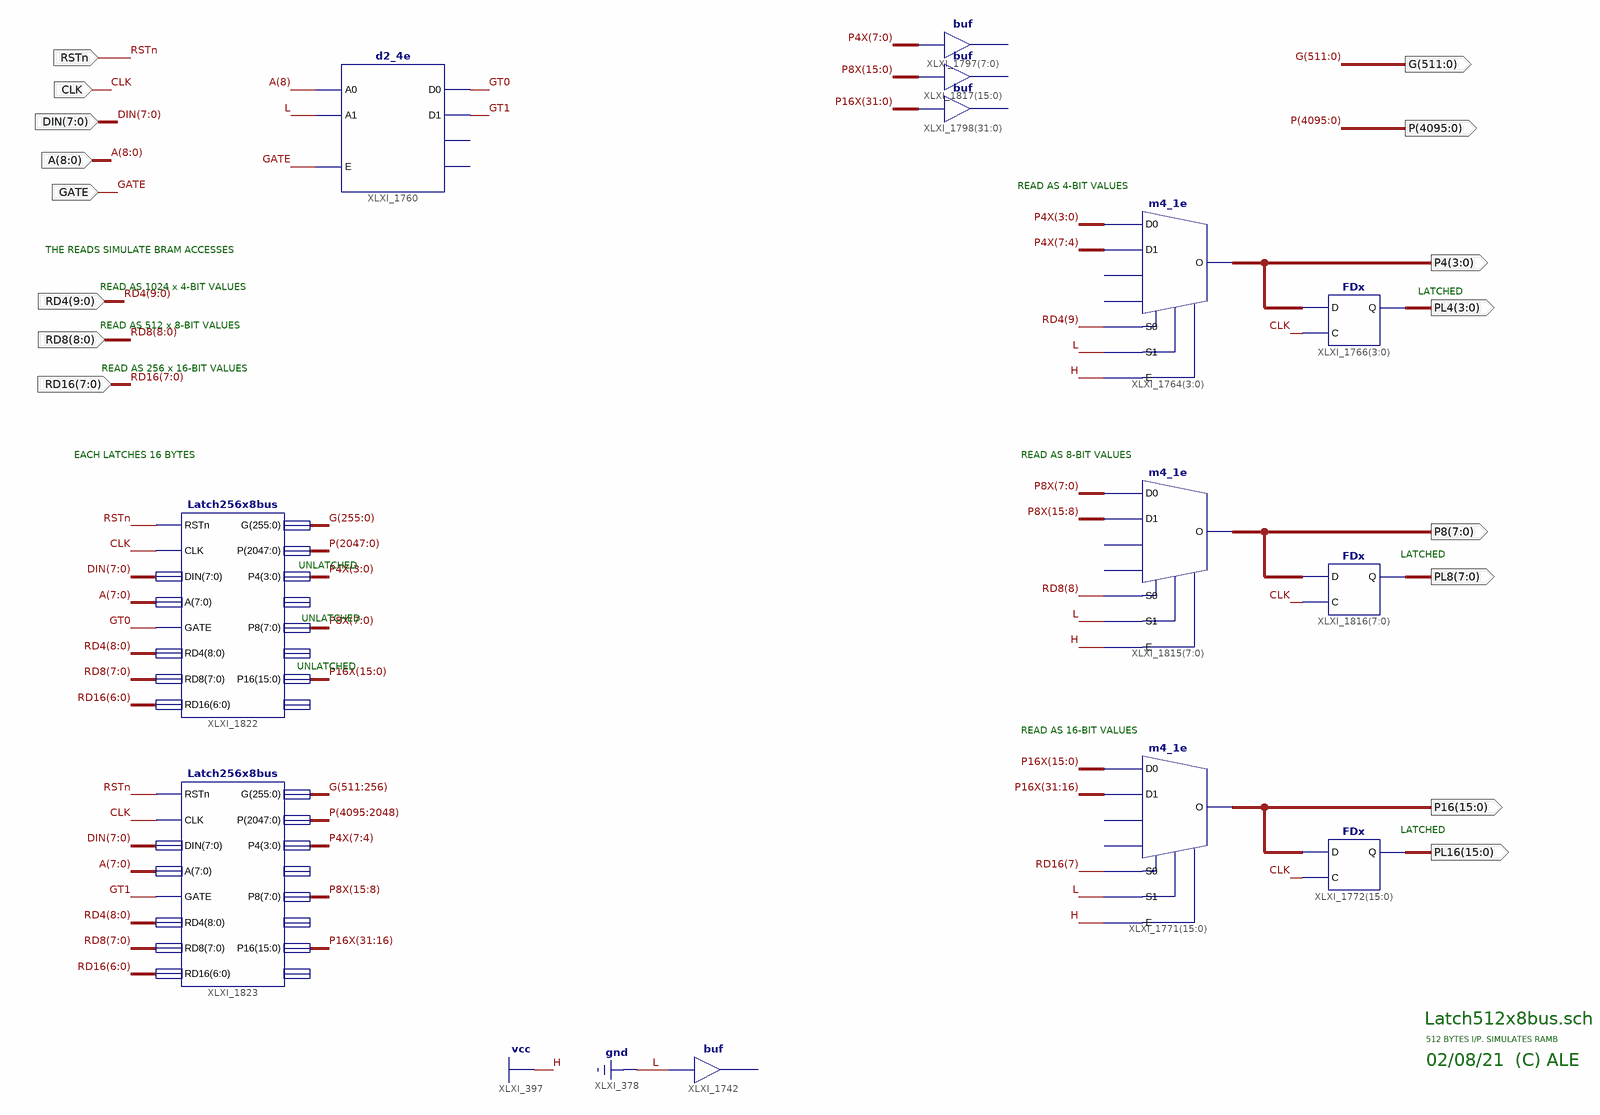
[diagram p0: schematic sheet 1]
// Xilinx ISE schematic Latch512x8bus.sch (spartan3e) as structural Verilog: 13 symbols, 22 ports
module Latch512x8bus (
  input  RSTn,
  input  [7:0] DIN,
  input  CLK,
  input  GATE,
  input  [9:0] RD4,
  input  [8:0] RD8,
  input  [7:0] RD16,
  input  [8:0] A,
  output [4095:0] P,
  output [3:0] P4,
  output [3:0] PL4,
  output [15:0] P16,
  output [15:0] PL16,
  output [7:0] P8,
  output [7:0] PL8,
  output [511:0] G
);

  wire GT0, GT1;
  wire [7:0] P4X;
  wire [15:0] P8X;
  wire [31:0] P16X;

  // buf XLXI_1742 has open pins: I=1'b0, O=open
  d2_4e XLXI_1760 (.A0(A[8]), .A1(1'b0), .E(GATE), .D0(GT0), .D1(GT1));  // open: D2, D3
  // buf XLXI_1798[31..0] has open pins: I=P16X, O=open
  m4_1e XLXI_1764[3:0] (.D0(P4X[3:0]), .D1(P4X[7:4]), .E(1'b1), .S0(RD4[9]), .S1(1'b0), .O(P4));  // open: D2, D3
  FDx XLXI_1766[3:0] (.C(CLK), .D(P4), .Q(PL4));
  m4_1e XLXI_1771[15:0] (
    .D0(P16X[15:0]), .D1(P16X[31:16]), .E(1'b1), .S0(RD16[7]), .S1(1'b0), .O(P16));  // open: D2, D3
  FDx XLXI_1772[15:0] (.C(CLK), .D(P16), .Q(PL16));
  m4_1e XLXI_1815[7:0] (.D0(P8X[7:0]), .D1(P8X[15:8]), .E(1'b1), .S0(RD8[8]), .S1(1'b0), .O(P8));  // open: D2, D3
  FDx XLXI_1816[7:0] (.C(CLK), .D(P8), .Q(PL8));
  // buf XLXI_1797[7..0] has open pins: I=P4X, O=open
  // buf XLXI_1817[15..0] has open pins: I=P8X, O=open
  Latch256x8bus XLXI_1822 (
    .A(A[7:0]), .CLK(CLK), .DIN(DIN), .G(G[255:0]), .GATE(GT0), .P(P[2047:0]), .P16(P16X[15:0]),
    .P4(P4X[3:0]), .P8(P8X[7:0]), .RD16(RD16[6:0]), .RD4(RD4[8:0]), .RD8(RD8[7:0]), .RSTn(RSTn));  // open: PL16, PL4, PL8
  Latch256x8bus XLXI_1823 (
    .A(A[7:0]), .CLK(CLK), .DIN(DIN), .G(G[511:256]), .GATE(GT1), .P(P[4095:2048]), .P16(P16X[31:16]),
    .P4(P4X[7:4]), .P8(P8X[15:8]), .RD16(RD16[6:0]), .RD4(RD4[8:0]), .RD8(RD8[7:0]), .RSTn(RSTn));  // open: PL16, PL4, PL8

  // Notes on the sheet:
  //   READ AS 4-BIT VALUES
  //   THE READS SIMULATE BRAM ACCESSES
  //   READ AS 1024 x 4-BIT VALUES
  //   LATCHED
  //   READ AS 512 x 8-BIT VALUES
  //   READ AS 256 x 16-BIT VALUES
  //   EACH LATCHES 16 BYTES
  //   READ AS 8-BIT VALUES
  //   LATCHED
  //   UNLATCHED
  //   UNLATCHED
  //   UNLATCHED
  //   READ AS 16-BIT VALUES
  //   LATCHED
  //   Latch512x8bus.sch
  //   512 BYTES I/P. SIMULATES RAMB
  //   02/08/21  (C) ALE
endmodule
